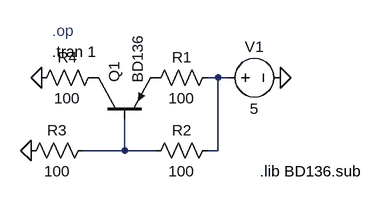
[diagram p0: schematic beta_measuring2.asc]
beta_measuring2.asc, the LTspice schematic file:
Version 4
SHEET 1 880 680
WIRE 304 112 288 112
WIRE 320 112 304 112
WIRE 160 224 160 176
WIRE 160 224 96 224
WIRE 208 224 160 224
WIRE 304 224 304 112
WIRE 304 224 288 224
FLAG 32 112 0
FLAG 16 224 0
FLAG 400 112 0
SYMBOL pnp 112 176 R270
SYMATTR InstName Q1
SYMATTR Value BD136
SYMBOL res 304 96 R90
WINDOW 0 0 56 VBottom 2
WINDOW 3 32 56 VTop 2
SYMATTR InstName R1
SYMATTR Value 100
SYMBOL res 304 208 R90
WINDOW 0 0 56 VBottom 2
WINDOW 3 32 56 VTop 2
SYMATTR InstName R2
SYMATTR Value 100
SYMBOL res 112 208 R90
WINDOW 0 0 56 VBottom 2
WINDOW 3 32 56 VTop 2
SYMATTR InstName R3
SYMATTR Value 100
SYMBOL res 128 96 R90
WINDOW 0 0 56 VBottom 2
WINDOW 3 32 56 VTop 2
SYMATTR InstName R4
SYMATTR Value 100
SYMBOL voltage 304 112 R270
WINDOW 0 32 56 VTop 2
WINDOW 3 -32 56 VBottom 2
WINDOW 123 0 0 Left 0
WINDOW 39 0 0 Left 0
SYMATTR InstName V1
SYMATTR Value 5
TEXT 48 40 Left 2 ;.op
TEXT 368 256 Left 2 !.lib BD136.sub
TEXT 48 72 Left 2 !.tran 1

The netlist it stands for:
* beta_measuring2.asc
Q1 P001 N002 P002 0 BD136
R1 N001 P002 100
R2 N001 N002 100
R3 N002 0 100
R4 P001 0 100
V1 N001 0 5
.model NPN NPN
.model PNP PNP
.lib standard.bjt
* .op
.lib BD136.sub
.tran 1
.backanno
.end